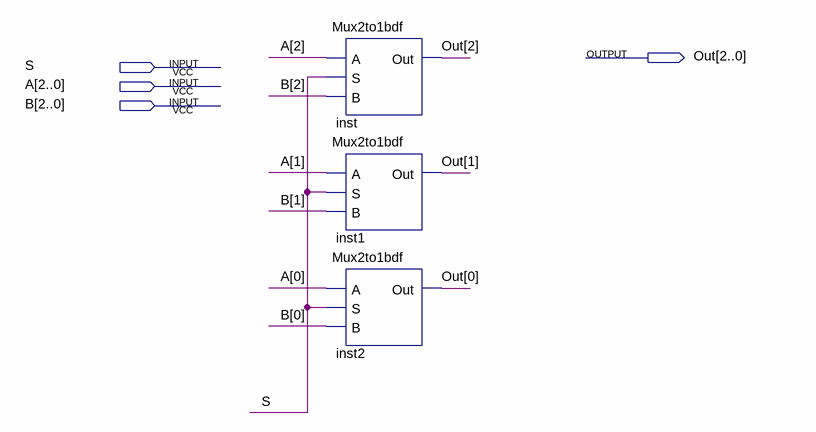
[diagram p0: schematic sheet]
// Quartus schematic Mux2to1_3bit.bdf as structural Verilog: 3 symbols, 4 pins
module Mux2to1_3bit (
  input  S,
  input  [2:0] A,
  input  [2:0] B,
  output [2:0] Out
);

  Mux2to1bdf inst (.A(A[2]), .S(S), .B(B[2]), .Out(Out[2]));
  Mux2to1bdf inst1 (.A(A[1]), .S(S), .B(B[1]), .Out(Out[1]));
  Mux2to1bdf inst2 (.A(A[0]), .S(S), .B(B[0]), .Out(Out[0]));
endmodule
